# EAGLE design midi_thru (EAGLE 7.6.0)
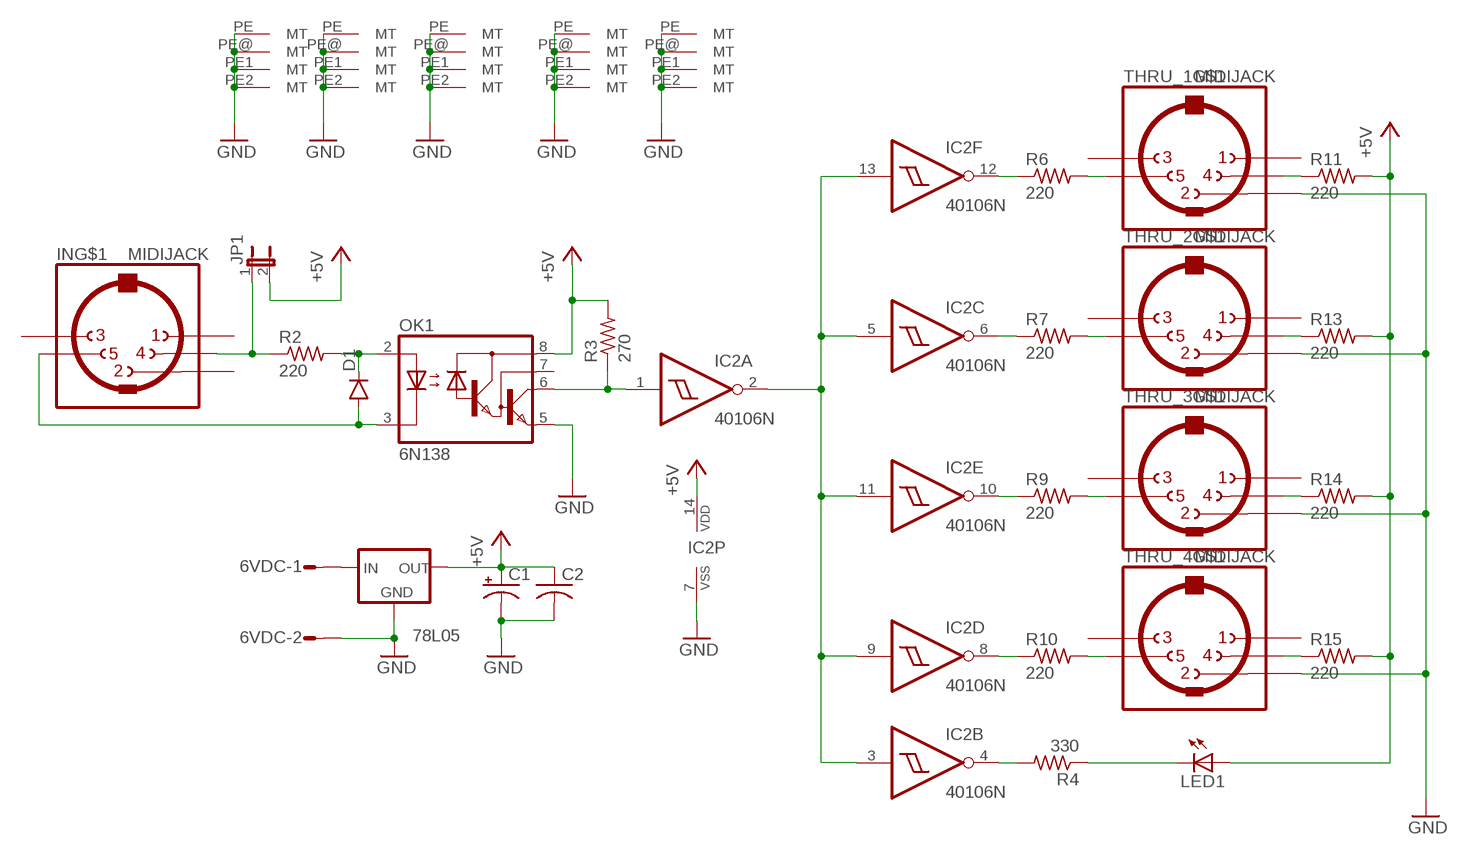
[diagram p0: schematic, sheet 1]

## Parts
6VDC  S02P  [S02P]
78L05  79LXX  [79LXX]
C1  CPOL-USB45181A  [B45181A]
C2  C-US025-024X044  [C025-024X044]
D1  DIODE1N4148  [DIODE-1N4148]
IC2  40106N  [DIL14]
IN  MIDIJACK  [CP-2350]
JP1  JP1E  [JP1]
LED1  LED5MM  [LED5MM]
OK1  6N138  [DIL08]
R2  220  R-US_0207/7  [0207/7]
R3  270  R-US_0207/7  [0207/7]
R4  330  R-US_0207/7  [0207/7]
R6  220  R-US_0207/7  [0207/7]
R7  220  R-US_0207/7  [0207/7]
R9  220  R-US_0207/7  [0207/7]
R10  220  R-US_0207/7  [0207/7]
R11  220  R-US_0207/7  [0207/7]
R13  220  R-US_0207/7  [0207/7]
R14  220  R-US_0207/7  [0207/7]
R15  220  R-US_0207/7  [0207/7]
THRU_1  MIDIJACK  [CP-2350]
THRU_2  MIDIJACK  [CP-2350]
THRU_3  MIDIJACK  [CP-2350]
THRU_4  MIDIJACK  [CP-2350]

## Nets
+5V: 78L05.OUT C1.+ C2.1 IC2.14(P:VDD) JP1.2 LED1.A OK1.8(VCC) R3.2 R11.2 R13.2 R14.2 R15.2
GND: 6VDC.2 78L05.GND C1.- C2.2 IC2.7(P:VSS) IN.PE1(MT) IN.PE2(MT) IN.PE(MT) IN.PE@(MT) OK1.5(GND) THRU_1.2 THRU_1.PE1(MT) THRU_1.PE2(MT) THRU_1.PE(MT) THRU_1.PE@(MT) THRU_2.2 THRU_2.PE1(MT) THRU_2.PE2(MT) THRU_2.PE(MT) THRU_2.PE@(MT) THRU_3.2 THRU_3.PE1(MT) THRU_3.PE2(MT) THRU_3.PE(MT) THRU_3.PE@(MT) THRU_4.2 THRU_4.PE1(MT) THRU_4.PE2(MT) THRU_4.PE(MT) THRU_4.PE@(MT)
N$1: 6VDC.1 78L05.IN
N$2: IC2.4(B:O) R4.2
N$3: D1.A IN.5 OK1.3(C)
N$4: LED1.K(C) R4.1
N$5: IC2.8(D:O) R10.1
N$6: IN.4 JP1.1 R2.1
N$7: D1.C OK1.2(A) R2.2
N$8: IC2.10(E:O) R9.1
N$9: IC2.12(F:O) R6.1
N$17: IC2.2(A:O) IC2.3(B:I) IC2.5(C:I) IC2.9(D:I) IC2.11(E:I) IC2.13(F:I)
N$23: IC2.6(C:O) R7.1
N$26: R6.2 THRU_1.5
N$27: R7.2 THRU_2.5
N$28: R9.2 THRU_3.5
N$30: IC2.1(A:I) OK1.6(VO) R3.1
N$32: R10.2 THRU_4.5
N$33: R11.1 THRU_1.4
N$34: R13.1 THRU_2.4
N$35: R14.1 THRU_3.4
N$36: R15.1 THRU_4.4
Unconnected: IN.1 IN.2 IN.3 OK1.7(VB) THRU_1.1 THRU_1.3 THRU_2.1 THRU_2.3 THRU_3.1 THRU_3.3 THRU_4.1 THRU_4.3

## Library data of the parts
6VDC = con-amp-mt:S02P: AMP MT CONNECTOR; OC_FARNELL: unknown; OC_NEWARK: unknown
78L05 = v-reg:79LXX: VOLTAGE REGULATOR
C1 = rcl:CPOL-US: POLARIZED CAPACITOR, American symbol
C2 = rcl:C-US: CAPACITOR, American symbol
D1 = SparkFun-DiscreteSemi:DIODE: Diode These are standard reverse protection diodes and small signal diodes. SMA package can handle up to about 1A. SOD-323 can handle about 200mA. What the SOD-323 package when ordering, there are some mfgs out there that are 5-pin packages.
IC2 = 40xx:40106: Hex SCHMITT TRIGGER
IN THRU_1-THRU_4 = adafruit:MIDIJACK: DIN 5 jack also known as MIDI jack A modification of conn-hirshman:MAB5SH with two options for the grounding 'teeth'
JP1 = jumper:JP1E: JUMPER
LED1 = led:LED: LED OSRAM: - CHIPLED LG R971, LG N971, LY N971, LG Q971, LY Q971, LO R971, LY R971 LH N974, LH R974 LS Q976, LO Q976, LY Q976 LO Q996 - Hyper CHIPLED LW Q18S LB Q993, LB Q99A, LB R99A - SideLED LS A670, LO A670, LY A670, LG A670, LP A670 LB A673, LV A673, LT A673, LW A673 LH A674 LY A675 LS A676, LA A676, LO A676, LY A676, LW A676 LS A679, LY A679, LG A679 - Hyper Micro SIDELED® LS Y876, LA Y876, LO Y876, LY Y876 LT Y87S - SmartLED LW L88C, LW L88S LB L89C, LB L89S, LG L890 LS L89K, LO L89K, LY L89K LS L896, LA L896, LO L896, LY L896 - TOPLED LS T670, LO T670, LY T670, LG T670, LP T670 LSG T670, LSP T670, LSY T670, LOP T670, LYG T670 LG T671, LOG T671, LSG T671 LB T673, LV T673, LT T673, LW T673 LH T674 LS T676, LA T676, LO T676, LY T676, LB T676, LH T676, LSB T676, LW T676 LB T67C, LV T67C, LT T67C, LS T67K, LO T67K, LY T67K, LW E67C LS E67B, LA E67B, LO E67B, LY E67B, LB E67C, LV E67C, LT E67C LW T67C LS T679, LY T679, LG T679 LS T770, LO T770, LY T770, LG T770, LP T770 LB T773, LV T773, LT T773, LW T773 LH T774 LS E675, LA E675, LY E675, LS T675 LS T776, LA T776, LO T776, LY T776, LB T776 LHGB T686 LT T68C, LB T68C - Hyper Mini TOPLED® LB M676 - Mini TOPLED Santana® LG M470 LS M47K, LO M47K, LY M47K Source: http://www.osram.convergy.de LUXEON: - LUMILED® LXK2-PW12-R00, LXK2-PW12-S00, LXK2-PW14-U00, LXK2-PW14-V00 LXK2-PM12-R00, LXK2-PM12-S00, LXK2-PM14-U00 LXK2-PE12-Q00, LXK2-PE12-R00, LXK2-PE12-S00, LXK2-PE14-T00, LXK2-PE14-U00 LXK2-PB12-K00, LXK2-PB12-L00, LXK2-PB12-M00, LXK2-PB14-N00, LXK2-PB14-P00, LXK2-PB14-Q00 LXK2-PR12-L00, LXK2-PR12-M00, LXK2-PR14-Q00, LXK2-PR14-R00 LXK2-PD12-Q00, LXK2-PD12-R00, LXK2-PD12-S00 LXK2-PH12-R00, LXK2-PH12-S00 LXK2-PL12-P00, LXK2-PL12-Q00, LXK2-PL12-R00 Source: www.luxeon.com KINGBRIGHT: KA-3528ASYC Source: www.kingbright.com
OK1 = optocoupler:6N138: MOTOROLA OPTO COUPLER; MF: VISHAY/TELEFUNKEN; MPN: 6N138; OC_FARNELL: 9860150; OC_NEWARK: 35K5294
R2-R4 R6 R7 R9-R11 R13-R15 = rcl:R-US_: RESISTOR, American symbol

## Net classes
1 GND: width 1.016 mm, drill 1.016 mm, clearance 0.508 mm

## Board
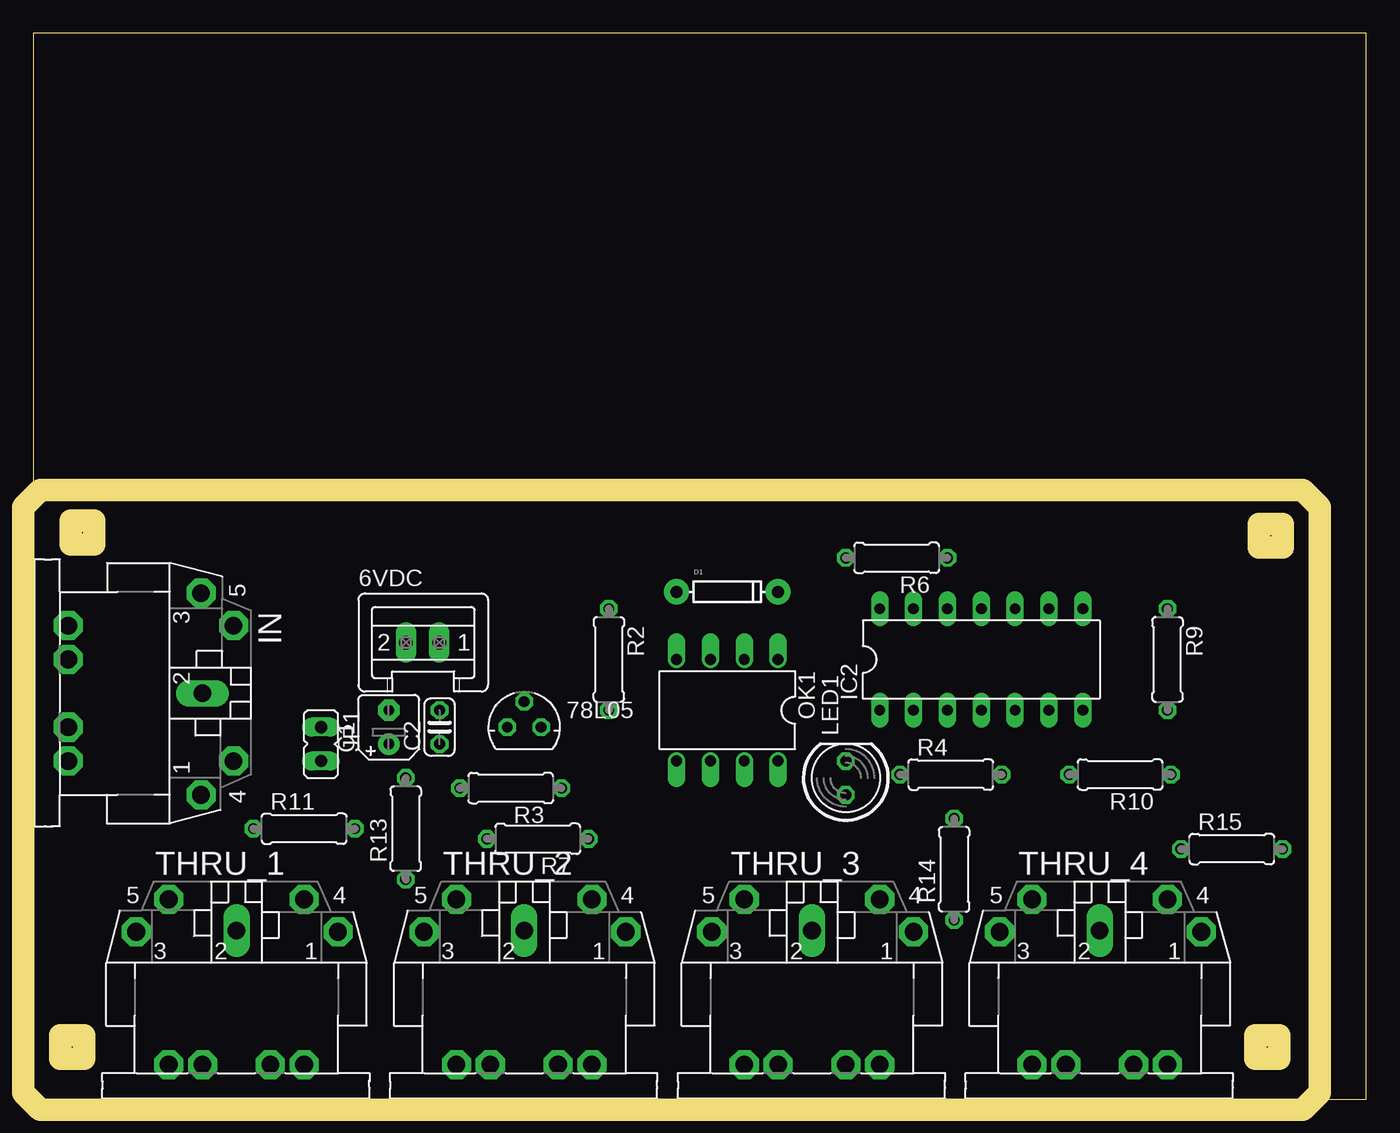
[diagram p1: board, top side]
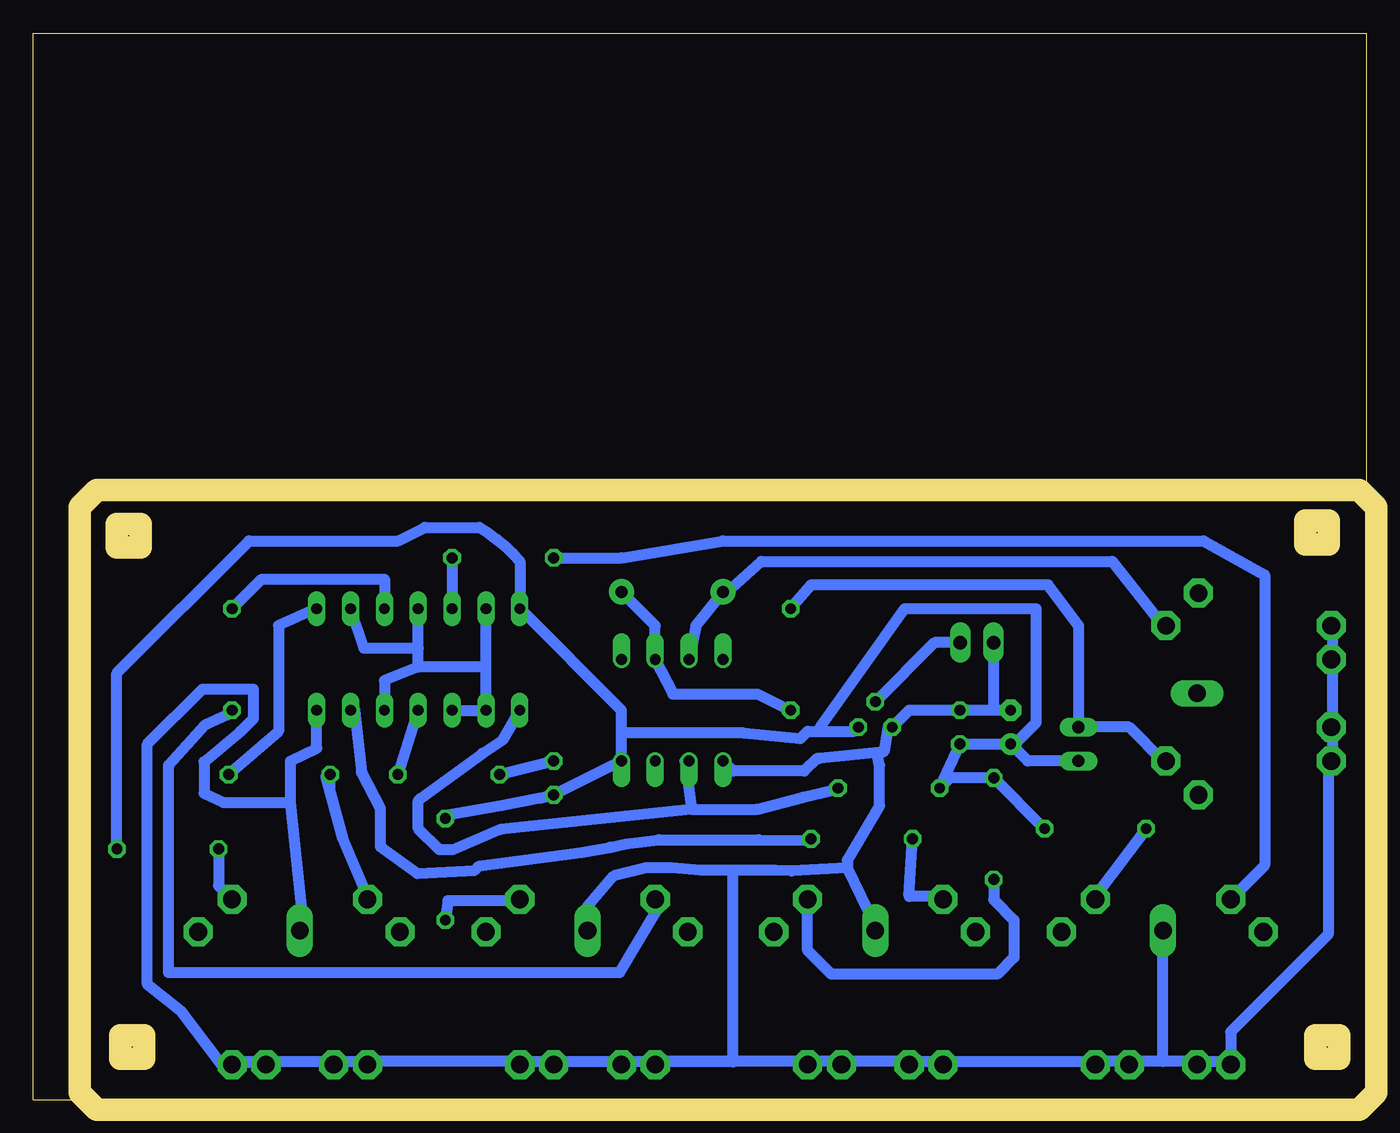
[diagram p2: board, bottom side, seen from below]

Size 100 x 80.01 mm. Coordinates in mm from the lower left corner, seen from the top.
Outline: 100,0.01 100,80.01 0,80.01 0,0.01
Outline: 100,0 0,0
Copper layers (1*16): Top 0.035mm / dielectric 1.5mm / Bottom 0.035mm
Design rules "default *": minimum track width 32mil, minimum drill 31mil, track to track 18mil, track to pad 18mil, pad to pad 18mil, via to via 18mil, smd to smd 8mil, copper to edge 0mil, drill to drill 18mil, minimum pad ring 10mil, minimum via ring 8mil, stop-mask expansion 4mil, vias tented up to drill 0mil, thermal gap 10mil
Holes 0.6 mm at 3.3,43.44 92.71,43.19 92.71,3.82 2.54,4.84
Milling: 24 lines

### Footprints (pad centres in the part's own frame; a part is rotated, then mirrored left to right if it is on the bottom)
S02P = drill 1.016 long: 1 1.25,0; 2 -1.25,0
79LXX = drill 0.813 octagon: GND -1.27,0; IN 0,1.905; OUT 1.27,0
B45181A = drill 0.813 pad 1.6: + -1.27,0 | drill 0.813 pad 1.6 octagon: - 1.27,0
C025-024X044 = drill 0.813 octagon: 1 -1.27,0; 2 1.27,0
DIODE-1N4148 = drill 0.9 pad 1.88: A -3.81,0; C 3.81,0
DIL14 = drill 0.813 long: 1 -7.62,-3.81; 2 -5.08,-3.81; 3 -2.54,-3.81; 4 0,-3.81; 5 2.54,-3.81; 6 5.08,-3.81; 7 7.62,-3.81; 8 7.62,3.81; 9 5.08,3.81; 10 2.54,3.81; 11 0,3.81; 12 -2.54,3.81; 13 -5.08,3.81; 14 -7.62,3.81
CP-2350 = drill 1.321 pad 2.184 octagon: 1 7.62,12.58; 3 -7.52,12.58; 4 5.08,15.02; 5 -5.08,15.02; PE -2.54,2.62; PE1 -5.08,2.62; PE2 5.08,2.62; PE@ 2.54,2.62 | drill 1.321 long: 2 0,12.68
JP1 = drill 0.914 long: 1 0,-1.27; 2 0,1.27
LED5MM = drill 0.813 octagon: A -1.27,0; K 1.27,0
DIL08 = drill 0.813 offset: 1 -3.81,-3.81; 2 -1.27,-3.81; 3 1.27,-3.81; 4 3.81,-3.81; 5 3.81,3.81; 6 1.27,3.81; 7 -1.27,3.81; 8 -3.81,3.81
0207/7 = drill 0.813 octagon: 1 -3.81,0; 2 3.81,0

### Placement (x,y rotation side)
6VDC  29.21,34.3 0 top
78L05  36.83,27.95 0 top
C1  26.67,27.95 90 top
C2  30.48,27.95 90 top
D1  52.07,38.11 0 top
IC2  71.12,33.03 0 top
IN  0,30.49 270 top
JP1  21.59,26.68 180 top
LED1  60.96,24.14 90 top
OK1  52.07,29.22 180 top
R2  43.18,33.03 270 top
R3  35.81,23.38 180 top
R4  68.83,24.39 0 top
R6  64.77,40.65 180 top
R7  37.85,19.57 180 top
R9  85.09,33.03 270 top
R10  81.53,24.39 180 top
R11  20.32,20.33 0 top
R13  27.94,20.33 90 top
R14  69.09,17.28 90 top
R15  89.92,18.81 0 top
THRU_1  15.24,0.01 0 top
THRU_2  36.83,0.01 0 top
THRU_3  58.42,0.01 0 top
THRU_4  80.01,0.01 0 top

### Tracks (layer width: path | path; a pad name or v marks a point on that pad's centre or on a via)
+5V
  Bottom 0.813: 55.88,27.51 OK1.8 LED1.A 62.04,22.62 64.9,22.05 69.22,21.28 69.03,21.09 R14.2 | 55.88,27.51 55.88,29.22 IC2.14 63.5,40.4 arc-18 66.55,42.94 70.61,42.94 72.64,41.92 83.82,41.92 93.73,32.01 R15.2 | C1.+ C2.1 R3.2 31.24,24.14 R13.2 R11.2 | 78L05.OUT 38.42,27.63 40.96,27.63 | 40.96,27.63 41.91,27.63 42.45,27.09 46.67,27.51 55.88,27.51 | C1.+ 26.35,26.68 24.77,28.27 24.77,36.84 34.61,36.84 40.96,27.95 40.96,27.63 | JP1.2 25.4,25.41 C1.+
GND
  Bottom 0.813: IN.PE1 2.54,35.57 2.54,33.03 IN.PE 2.54,32.71 2.54,28.27 IN.PE@ 2.54,27.95 2.54,25.41 IN.PE2 2.86,25.09 2.86,12.39 10.16,5.09 THRU_1.PE1 10.16,2.87 12.38,2.87 THRU_1.PE 12.7,2.87 15.24,2.87 | 15.24,2.87 THRU_1.2 15.24,13.03 | 15.24,2.87 17.78,2.87 THRU_1.PE@ 18.1,2.87 20.32,2.87 THRU_1.PE2 20.64,2.87 31.43,2.87 THRU_2.PE1 31.75,2.87 33.97,2.87 THRU_2.PE 34.29,2.87 39.37,2.87 THRU_2.PE@ 39.69,2.87 41.91,2.87 THRU_2.PE2 42.23,2.87 53.02,2.87 THRU_3.PE1 53.34,2.87 55.88,2.87 THRU_3.PE 56.2,2.87 | C1.- 27.94,29.22 | 27.94,29.22 C2.2 34.29,29.22 78L05.GND 35.88,27.95 36.2,26.11 | 48.26,24.14 OK1.5 47.5,24.65 42.16,24.65 41.21,25.6 41.02,25.6 36.2,26.11 | 27.94,29.22 27.94,34.3 6VDC.2 | IC2.7 78.74,26.36 80.71,25.41 80.71,22.3 | 80.71,22.3 79.69,12.71 80.01,12.71 THRU_4.2 | 82.23,2.87 77.79,2.87 THRU_4.PE 77.47,2.87 74.93,2.87 THRU_4.PE1 74.61,2.87 63.82,2.87 THRU_3.PE2 63.5,2.87 60.96,2.87 THRU_3.PE@ 60.64,2.87 56.2,2.87 | 82.23,2.87 THRU_4.PE@ 82.55,2.87 85.09,2.87 THRU_4.PE2 85.09,3.18 | THRU_3.2 58.42,14.49 56.45,16.77 54.04,17.41 52.13,17.41 49.91,17.22 47.75,17.22 | 47.75,17.22 44.32,17.22 43.12,17.16 38.92,17.41 | 38.92,17.41 36.83,13.03 THRU_2.2 | 80.71,22.3 85.72,22.3 87.19,23 87.19,25.35 84.45,27.63 83.5,28.59 83.5,30.81 87.31,30.81 91.44,26.68 91.44,8.65 88.9,6.61 85.85,2.61 82.23,2.87 | 36.2,26.11 36.7,26.05 36.51,25.09 36.51,22.05 38.92,17.98 38.92,17.41 | 56.2,2.87 47.56,2.87 47.5,2.8 47.5,16.96 47.75,17.22
N$1
  Bottom 0.813: 78L05.IN 32.38,34.3 6VDC.1
N$2
  Bottom 0.813: IC2.4 R4.2
N$3
  Bottom 0.813: OK1.3 50.29,35.57 D1.A 47.94,38.11 45.4,40.4 19.05,40.4 15.24,35.57 IN.5
N$4
  Bottom 0.813: R4.1 LED1.K
N$5
  Bottom 0.813: R10.1 81.6,27.63 81.6,35.57 IC2.8
N$6
  Bottom 0.813: R2.1 41.66,38.62 23.88,38.62 21.59,35.57 JP1.1 17.78,27.95 15.24,25.41 IN.4
N$7
  Bottom 0.813: R2.2 45.66,30.43 52.01,30.43 OK1.2 53.34,35.57 D1.C
N$8
  Bottom 0.813: IC2.10 73.66,39.06 82.87,39.06 R9.1
N$9
  Bottom 0.813: R6.1 IC2.12
N$17
  Bottom 0.813: IC2.3 IC2.2 66.04,32.46 | 66.04,32.46 IC2.13 | IC2.5 73.66,31.44 71.12,32.46 | 66.04,32.46 71.12,32.46 | 71.12,32.46 71.12,33.86 | 71.12,33.86 IC2.11 | IC2.9 75.18,33.86 71.12,33.86
N$23
  Bottom 0.813: R7.1 41.53,19.44 42.1,19.44 45.59,19.5 53.09,19.5 55.56,19.19 56.71,18.93 58.86,18.55 66.55,17.54 66.86,17.22 71.18,16.96 73.98,19 73.98,21.85 75.37,24.52 75.88,29.22 IC2.6
N$26
  Bottom 0.813: R6.2 55.88,40.65 48.26,41.92 12.19,41.92 7.62,39.38 7.62,17.57 THRU_1.5
N$27
  Bottom 0.813: R7.2 34.29,15.25 31.75,15.25 THRU_2.5
N$28
  Bottom 0.813: R9.2 85.41,28.9 87.06,28.14 89.85,25.09 89.85,9.54 56.01,9.54 53.34,13.98 THRU_3.5
N$30
  Bottom 0.813: R3.1 40.07,23.19 42.29,22.68 45.72,21.79 50.61,21.79 | 50.61,21.79 51.12,25.41 OK1.6 | IC2.1 64.77,27 66.29,25.98 70.93,22.62 71.12,22.43 71.12,20.33 69.53,18.74 68.52,18.74 64.96,20.27 50.61,21.79
N$32
  Bottom 0.813: R10.2 77.72,23.06 78.04,24.27 76.77,19.57 74.93,15.25 THRU_4.5
N$33
  Bottom 0.813: R11.1 20.32,15.25 THRU_1.4
N$34
  Bottom 0.813: 41.91,14.93 THRU_2.4 41.91,11.19 40.13,9.41 27.69,9.41 26.42,10.68 26.42,13.47 27.94,15 R13.1
N$35
  Bottom 0.813: R14.1 68.9,14.93 63.5,14.93 THRU_3.4
N$36
  Bottom 0.813: 85.09,15.25 THRU_4.4 86.11,16.05 R15.1